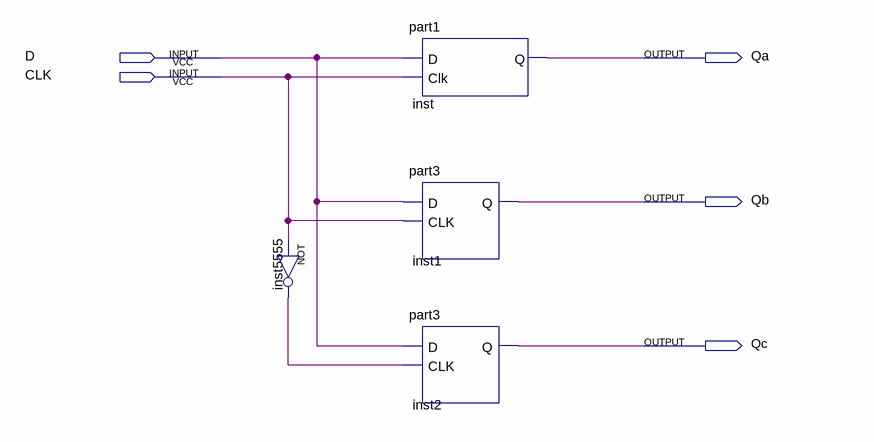
[diagram p0: schematic sheet]
// Quartus schematic part4.bdf as structural Verilog: 4 symbols, 5 pins
module part4 (
  input  D,
  input  CLK,
  output Qa,
  output Qb,
  output Qc
);

  wire inst5555_out;

  not inst5555 (inst5555_out, CLK);
  part1 inst (.D(D), .Clk(CLK), .Q(Qa));
  part3 inst1 (.D(D), .CLK(CLK), .Q(Qb));
  part3 inst2 (.D(D), .CLK(inst5555_out), .Q(Qc));
endmodule
